# EAGLE design HHKBLite2BTwithoutArduinoFTDI (EAGLE 6.5.0)
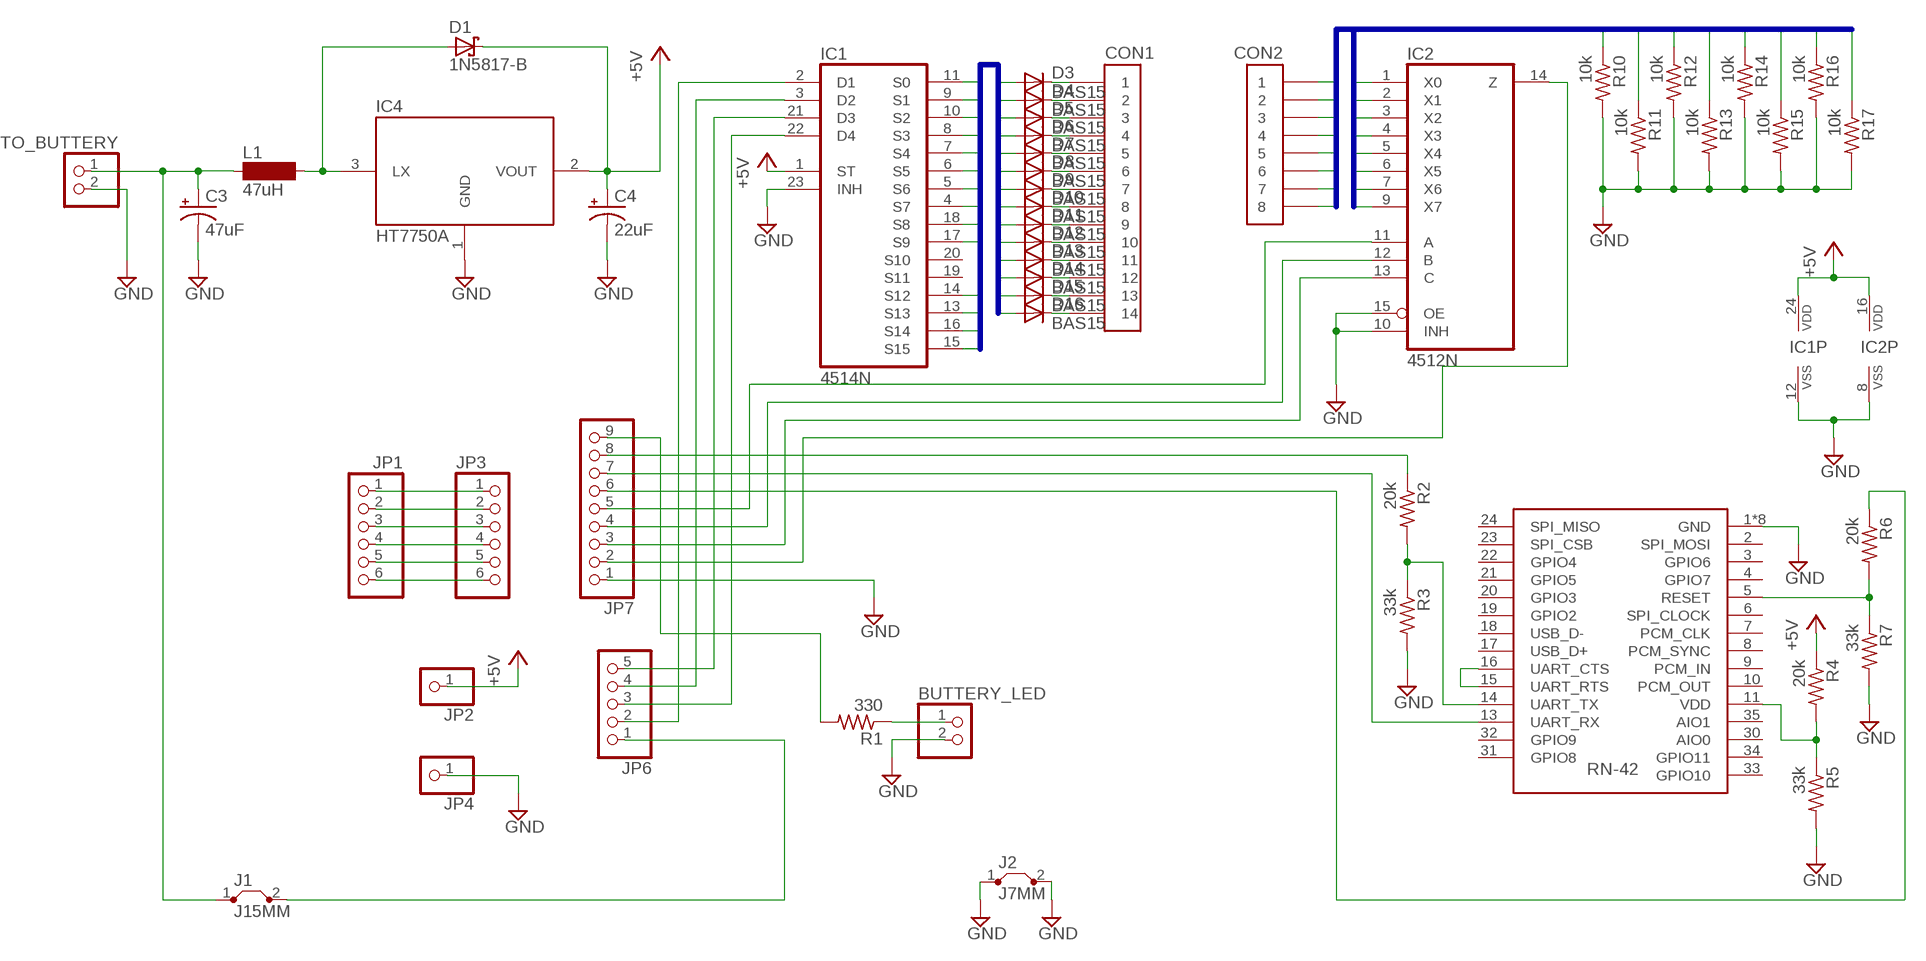
[diagram p0: schematic, sheet 1]

## Parts
BUTTERY_LED  PINHD-1X2  [1X02]
C3  47uF  CPOL-USE5-10.5  [E5-10,5]
C4  22uF  CPOL-USE5-10.5  [E5-10,5]
CON1  45045-1445  [52045-1445]
CON2  45045-0845  [52045-0845]
D1  1N5817-B  [DO41-7.6]
D3  BAS15  [DO34-7]
D4  BAS15  [DO34-7]
D5  BAS15  [DO34-7]
D6  BAS15  [DO34-7]
D7  BAS15  [DO34-7]
D8  BAS15  [DO34-7]
D9  BAS15  [DO34-7]
D10  BAS15  [DO34-7]
D11  BAS15  [DO34-7]
D12  BAS15  [DO34-7]
D13  BAS15  [DO34-7]
D14  BAS15  [DO34-7]
D15  BAS15  [DO34-7]
D16  BAS15  [DO34-7]
IC1  4514N  [DIL24-6]
IC2  4512N  [DIL16]
IC4  HT7750A  [TO-92]
J1  J15MM  [15]
J2  J7MM  [07]
JP1  PINHD-1X6  [1X06]
JP2  PINHD-1X1  [1X01]
JP3  PINHD-1X6/90  [1X06/90]
JP4  PINHD-1X1  [1X01]
JP6  PINHD-1X5  [1X05]
JP7  PINHD-1X9  [1X09]
L1  47uH  BS11  [BS11]
R1  330  R-US_0207/7  [0207/7]
R2  20k  R-US_0207/7  [0207/7]
R3  33k  R-US_0207/7  [0207/7]
R4  20k  R-US_0207/7  [0207/7]
R5  33k  R-US_0207/7  [0207/7]
R6  20k  R-US_0207/7  [0207/7]
R7  33k  R-US_0207/7  [0207/7]
R10  10k  R-US_0207/7  [0207/7]
R11  10k  R-US_0207/7  [0207/7]
R12  10k  R-US_0207/7  [0207/7]
R13  10k  R-US_0207/10  [0207/10]
R14  10k  R-US_0207/7  [0207/7]
R15  10k  R-US_0207/7  [0207/7]
R16  10k  R-US_0207/7  [0207/7]
R17  10k  R-US_0207/7  [0207/7]
TO_BUTTERY  PINHD-1X2  [1X02]
U$1  RN-42  [RN-42]

## Nets
+5V [Vcc]: C4.+ D1.C IC1.1(ST) IC1.24(VDD) IC2.16(VDD) IC4.2(VOUT) JP2.1 R4.1
CON1BUS_O0: D3.A IC1.11(S0)
CON1BUS_O1: D5.A IC1.9(S1)
CON1BUS_O2: D4.A IC1.10(S2)
CON1BUS_O3: D6.A IC1.8(S3)
CON1BUS_O4: D7.A IC1.7(S4)
CON1BUS_O5: D8.A IC1.6(S5)
CON1BUS_O6: D9.A IC1.5(S6)
CON1BUS_O7: D10.A IC1.4(S7)
CON1BUS_O8: D11.A IC1.18(S8)
CON1BUS_O9: D16.A IC1.17(S9)
CON1BUS_O12: D13.A IC1.14(S12)
CON1BUS_O13: D12.A IC1.13(S13)
CON1BUS_O14: D15.A IC1.16(S14)
CON1BUS_O15: D14.A IC1.15(S15)
CON2BUS_D0: CON2.8 IC2.1(X0) R10.1
CON2BUS_D1: CON2.7 IC2.2(X1) R11.1
CON2BUS_D2: CON2.6 IC2.3(X2) R12.1
CON2BUS_D3: CON2.5 IC2.4(X3) R13.1
CON2BUS_D4: CON2.4 IC2.5(X4) R14.1
CON2BUS_D5: CON2.3 IC2.6(X5) R15.1
CON2BUS_D6: CON2.2 IC2.7(X6) R16.1
CON2BUS_D7: CON2.1 IC2.9(X7) R17.1
GND [GND]: BUTTERY_LED.2 C3.- C4.- IC1.12(VSS) IC1.23(INH) IC2.8(VSS) IC2.10(INH) IC2.15(OE) IC4.1(GND) J2.1 J2.2 JP4.1 JP7.1 R3.2 R5.2 R7.2 R10.2 R11.2 R12.2 R13.2 R14.2 R15.2 R16.2 R17.2 TO_BUTTERY.2 U$1.1(GND) U$1.12(GND) U$1.28(GND) U$1.29(GND) U$1.GND1(GND) U$1.GND2(GND) U$1.GND3(GND) U$1.GND4(GND)
N$1: JP1.1 JP3.1
N$2: JP1.2 JP3.2
N$3 [VccSrc]: D1.A IC4.3(LX) L1.2
N$4 [VccSrc]: C3.+ J1.1 L1.1 TO_BUTTERY.1
N$5: JP1.3 JP3.3
N$6: JP7.6 R6.1
N$7: JP1.4 JP3.4
N$8: JP1.5 JP3.5
N$9: IC2.14(Z) JP7.2
N$10: JP1.6 JP3.6
N$12: J1.2 JP6.1
N$13: BUTTERY_LED.1 R1.1
N$14: JP7.9 R1.2
N$16: IC2.12(B) JP7.4
N$17: IC2.13(C) JP7.3
N$18: JP7.8 R2.1
N$19: JP7.7 U$1.13(UART_RX)
N$20: U$1.15(UART_RTS) U$1.16(UART_CTS)
N$21: R2.2 R3.1 U$1.14(UART_TX)
N$22: IC2.11(A) JP7.5
N$36: IC1.2(D1) JP6.2
N$37: IC1.3(D2) JP6.4
N$38: IC1.21(D3) JP6.5
N$39: IC1.22(D4) JP6.3
N$44: R4.2 R5.1 U$1.11(VDD)
N$46: R6.2 R7.1 U$1.5(RESET)
N$49: CON1.1 D3.C
N$50: CON1.2 D4.C
N$51: CON1.3 D5.C
N$52: CON1.4 D6.C
N$53: CON1.5 D7.C
N$54: CON1.6 D8.C
N$55: CON1.7 D9.C
N$56: CON1.8 D10.C
N$57: CON1.9 D11.C
N$58: CON1.10 D12.C
N$59: CON1.11 D13.C
N$60: CON1.12 D14.C
N$61: CON1.13 D15.C
N$62: CON1.14 D16.C
Unconnected: IC1.19(S11) IC1.20(S10) U$1.2(SPI_MOSI) U$1.3(GPIO6) U$1.4(GPIO7) U$1.6(SPI_CLOCK) U$1.7(PCM_CLK) U$1.8(PCM_SYNC) U$1.9(PCM_IN) U$1.10(PCM_OUT) U$1.17(USB_D+) U$1.18(USB_D-) U$1.19(GPIO2) U$1.20(GPIO3) U$1.21(GPIO5) U$1.22(GPIO4) U$1.23(SPI_CSB) U$1.24(SPI_MISO) U$1.30(AIO0) U$1.31(GPIO8) U$1.32(GPIO9) U$1.33(GPIO10) U$1.34(GPIO11) U$1.35(AIO1)

## Buses
CON2BUS_D[0..7]
CON1BUS_O[0..15]

## Library data of the parts
BUTTERY_LED TO_BUTTERY = pinhead:PINHD-1X2: PIN HEADER
C3 C4 = rcl:CPOL-US: POLARIZED CAPACITOR, American symbol
CON1 = 5204:45045-1445
CON2 = 5204:45045-0845
D1 = diode:1N581*: 1.0A SCHOTTKY BARRIER RECTIFIER Source: http://www.diodes.com/datasheets/ds23001.pdf
D3-D16 = diode:BAS15: DIODE high speed
IC1 = 45xx:4514: 4-bit latch 4-16 line DECODER
IC2 = 45xx:4512: 8-channel DATA SELECTOR Inhibit function corrected - 2005.10.04 librarian@cadsoft.de
IC4 = HT77XXA:HT7750A
J1 J2 = jumper:J: Bridge
JP1 JP3 = pinhead:PINHD-1X6: PIN HEADER
JP2 JP4 = pinhead:PINHD-1X1: PIN HEADER
JP6 = pinhead:PINHD-1X5: PIN HEADER
JP7 = pinhead:PINHD-1X9: PIN HEADER
L1 = inductor-neosid:BS: INDUCTOR nominal inductance, magnetically screened; OC_FARNELL: unknown; OC_NEWARK: unknown
R1-R7 R10-R12 R14-R17 = rcl:R-US_: RESISTOR, American symbol
R13 = resistor:R-US_: RESISTOR, American symbol
U$1 = RN-42:RN-42

## Net classes
0 default: clearance 0.254 mm
1 Vcc: width 0.025 mm, clearance 0.508 mm to class 0
2 VccSrc: clearance 0.508 mm to class 0, clearance 0.508 mm to class 1, clearance 0.508 mm
3 GND: clearance 0.305 mm to class 0, clearance 0.508 mm to class 1, clearance 0.508 mm to class 2

## Board
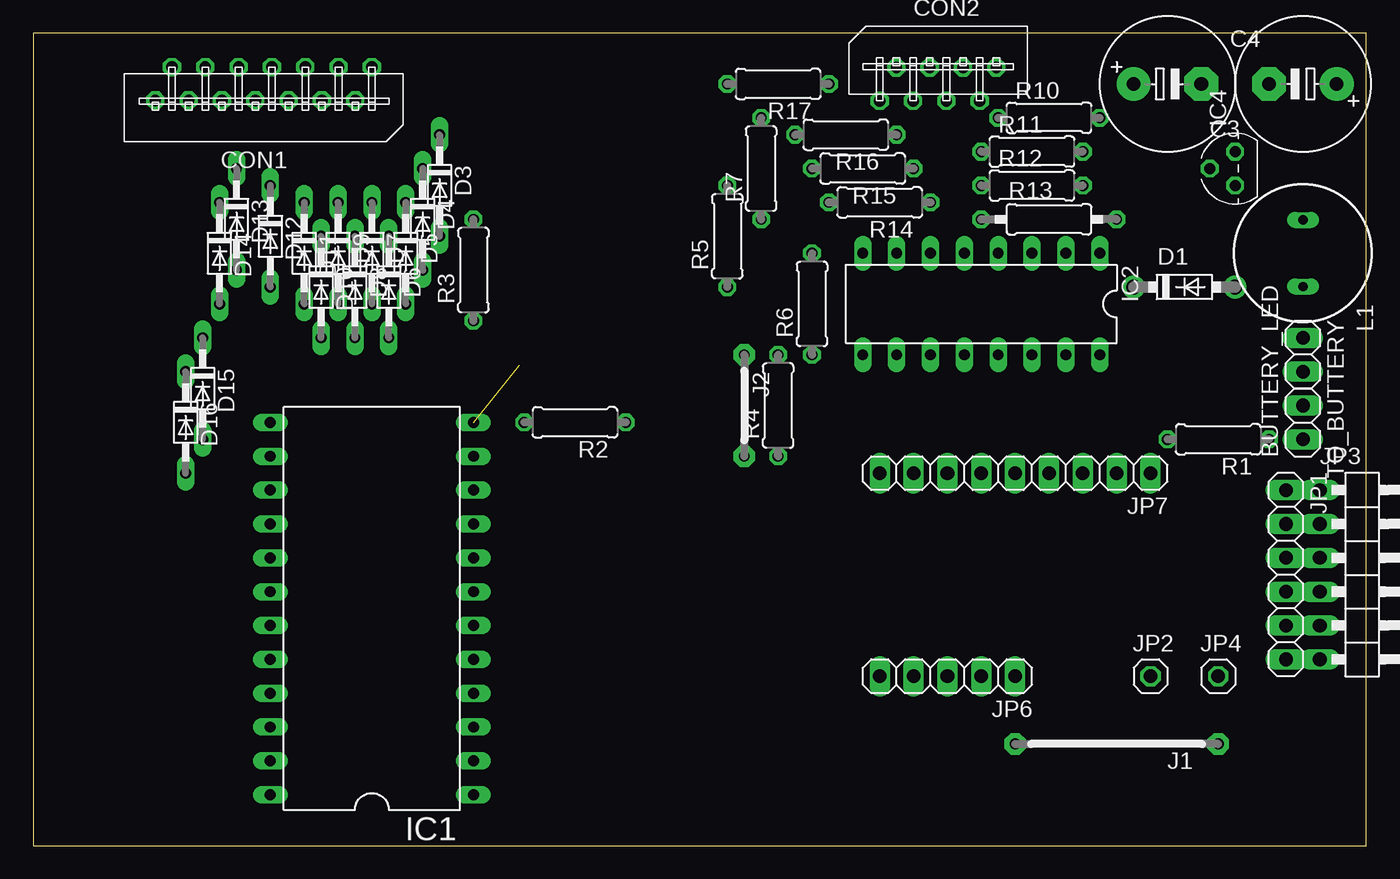
[diagram p1: board, top side]
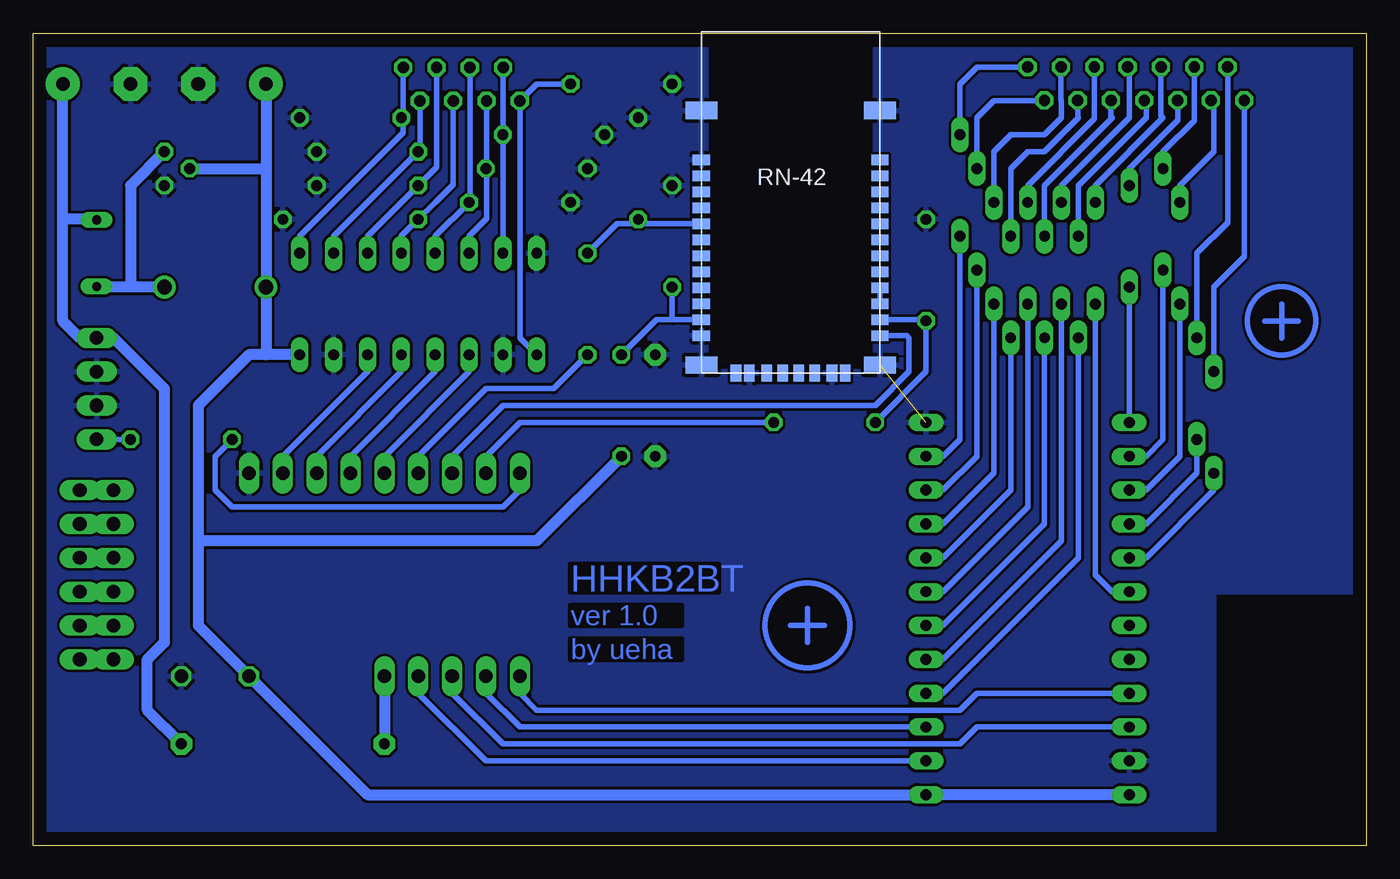
[diagram p2: board, bottom side, seen from below]

Size 100 x 60.95 mm. Coordinates in mm from the lower left corner, seen from the top.
Outline: 0,0 100,0 100,60.95 0,60.95 0,0
Copper layers (1*16): Top 0.035mm / dielectric 1.5mm / Bottom 0.035mm
Design rules "default": minimum track width 10mil, minimum drill 24mil, track to track 8mil, track to pad 8mil, pad to pad 8mil, via to via 8mil, smd to smd 8mil, copper to edge 40mil, drill to drill 8mil, minimum pad ring 10mil, minimum via ring 8mil, stop-mask expansion 4mil, vias tented up to drill 0mil, thermal gap 10mil

### Footprints (pad centres in the part's own frame; a part is rotated, then mirrored left to right if it is on the bottom)
1X02 = drill 1.016 long: 1 -1.27,0; 2 1.27,0
E5-10,5 = drill 1.016 pad 2.54: + -2.54,0 | drill 1.016 pad 2.54 octagon: - 2.54,0
52045-1445 = drill 0.85 octagon: 1 0,0; 2 1.25,2.5; 3 2.5,0; 4 3.75,2.5; 5 5,0; 6 6.25,2.5; 7 7.5,0; 8 8.75,2.5; 9 10,0; 10 11.25,2.5; 11 12.5,0; 12 13.75,2.5; 13 15,0; 14 16.25,2.5
52045-0845 = drill 0.85 octagon: 1 0,0; 2 1.25,2.5; 3 2.5,0; 4 3.75,2.5; 5 5,0; 6 6.25,2.5; 7 7.5,0; 8 8.75,2.5
DO41-7.6 = drill 1.1 pad 1.7: A 3.81,0; C -3.81,0
DO34-7 = drill 0.813 long: A 3.81,0; C -3.81,0
DIL24-6 = drill 0.813 long: 1 -13.97,-7.62; 2 -11.43,-7.62; 3 -8.89,-7.62; 4 -6.35,-7.62; 5 -3.81,-7.62; 6 -1.27,-7.62; 7 1.27,-7.62; 8 3.81,-7.62; 9 6.35,-7.62; 10 8.89,-7.62; 11 11.43,-7.62; 12 13.97,-7.62; 13 13.97,7.62; 14 11.43,7.62; 15 8.89,7.62; 16 6.35,7.62; 17 3.81,7.62; 18 1.27,7.62; 19 -1.27,7.62; 20 -3.81,7.62; 21 -6.35,7.62; 22 -8.89,7.62; 23 -11.43,7.62; 24 -13.97,7.62
DIL16 = drill 0.813 long: 1 -8.89,-3.81; 2 -6.35,-3.81; 3 -3.81,-3.81; 4 -1.27,-3.81; 5 1.27,-3.81; 6 3.81,-3.81; 7 6.35,-3.81; 8 8.89,-3.81; 9 8.89,3.81; 10 6.35,3.81; 11 3.81,3.81; 12 1.27,3.81; 13 -1.27,3.81; 14 -3.81,3.81; 15 -6.35,3.81; 16 -8.89,3.81
TO-92 = drill 0.813 octagon: 1 -1.27,0; 2 0,1.905; 3 1.27,0
15 = drill 0.813 pad 1.6 octagon: 1 -7.62,0; 2 7.62,0
07 = drill 0.813 pad 1.6 octagon: 1 -3.81,0; 2 3.81,0
1X06 = drill 1.016 long: 1 -6.35,0; 2 -3.81,0; 3 -1.27,0; 4 1.27,0; 5 3.81,0; 6 6.35,0
1X01 = drill 1.016 octagon: 1 0,0
1X06/90 = drill 1.016 long: 1 -6.35,-3.81; 2 -3.81,-3.81; 3 -1.27,-3.81; 4 1.27,-3.81; 5 3.81,-3.81; 6 6.35,-3.81
1X05 = drill 1.016 long: 1 -5.08,0; 2 -2.54,0; 3 0,0; 4 2.54,0; 5 5.08,0
1X09 = drill 1.016 long: 1 -10.16,0; 2 -7.62,0; 3 -5.08,0; 4 -2.54,0; 5 0,0; 6 2.54,0; 7 5.08,0; 8 7.62,0; 9 10.16,0
BS11 = drill 0.7 long: 1 -2.5,0; 2 2.5,0
0207/7 = drill 0.813 octagon: 1 -3.81,0; 2 3.81,0
0207/10 = drill 0.813 octagon: 1 -5.08,0; 2 5.08,0
RN-42 = smd 1.3 x 0.8: 1 -6.7,3.2; 2 -6.7,2; 3 -6.7,0.8; 4 -6.7,-0.4; 5 -6.7,-1.6; 6 -6.7,-2.8; 7 -6.7,-4; 8 -6.7,-5.2; 9 -6.7,-6.4; 10 -6.7,-7.6; 11 -6.7,-8.8; 12 -6.7,-10; 13 6.7,-10; 14 6.7,-8.8; 15 6.7,-7.6; 16 6.7,-6.4; 17 6.7,-5.2; 18 6.7,-4; 19 6.7,-2.8; 20 6.7,-1.6; 21 6.7,-0.4; 22 6.7,0.8; 23 6.7,2; 24 6.7,3.2 | smd 0.8 x 1.3: 28 3.1,-12.8; 29 -3.1,-12.8; 30 4.1,-12.8; 31 1.8,-12.8; 32 0.6,-12.8; 33 -0.6,-12.8; 34 -1.8,-12.8; 35 -4.1,-12.8 | smd 2.4 x 1.3: GND1 -6.7,6.9; GND2 6.7,6.9; GND3 -6.7,-12.2; GND4 6.7,-12.2

### Placement (x,y rotation side)
BUTTERY_LED  95.25,31.75 90 top
C3  95.25,57.15 180 top
C4  85.09,57.15 0 top
CON1  25.4,58.42 180 top
CON2  63.5,55.88 0 top
D1  86.36,41.91 0 top
D3  30.48,49.53 270 top
D4  29.21,46.99 270 top
D5  27.94,44.45 270 top
D6  26.67,41.91 270 top
D7  25.4,44.45 270 top
D8  24.13,41.91 270 top
D9  22.86,44.45 270 top
D10  21.59,41.91 270 top
D11  20.32,44.45 270 top
D12  17.78,45.72 270 top
D13  15.24,46.99 270 top
D14  13.97,44.45 270 top
D15  12.7,34.29 270 top
D16  11.43,31.75 270 top
IC1  25.4,17.78 90 top
IC2  71.12,40.64 180 top
IC4  90.17,50.8 90 top
J1  81.28,7.62 180 top
J2  53.34,33.02 270 top
JP1  93.98,20.32 270 top
JP2  83.82,12.7 0 top
JP3  100.33,20.32 270 top
JP4  88.9,12.7 0 top
JP6  68.58,12.7 180 top
JP7  73.66,27.94 180 top
L1  95.25,44.45 270 top
R1  88.9,30.48 180 top
R2  40.64,31.75 180 top
R3  33.02,43.18 90 top
R4  55.88,33.02 90 top
R5  52.07,45.72 90 top
R6  58.42,40.64 90 top
R7  54.61,50.8 90 top
R10  76.2,54.61 0 top
R11  74.93,52.07 0 top
R12  74.93,49.53 0 top
R13  76.2,46.99 0 top
R14  63.5,48.26 180 top
R15  62.23,50.8 180 top
R16  60.96,53.34 180 top
R17  55.88,57.15 180 top
TO_BUTTERY  95.25,36.83 270 top
U$1  43.18,48.26 0 bottom

### Tracks (layer width: path | path; a pad name or v marks a point on that pad's centre or on a via)
+5V
  Bottom 0.813: C4.+ 82.55,50.8 | 82.55,50.8 D1.C 82.55,36.83 | IC4.2 82.55,50.8 | R4.1 62.23,22.86 87.63,22.86 | 82.55,36.83 83.82,36.83 87.63,33.02 87.63,22.86 | IC2.16 82.55,36.83 | IC1.24 IC1.1 74.93,3.81 JP2.1 87.63,16.51 87.63,22.86
CON1BUS_O0
  Bottom 0.406: D3.A 30.48,30.48 31.75,29.21 IC1.11
CON1BUS_O1
  Bottom 0.406: D5.A 27.94,27.94 31.75,24.13 IC1.9
CON1BUS_O2
  Bottom 0.406: D4.A 29.21,29.21 31.75,26.67 IC1.10
CON1BUS_O3
  Bottom 0.406: D6.A 26.67,26.67 31.75,21.59 IC1.8
CON1BUS_O4
  Bottom 0.406: D7.A 25.4,25.4 31.75,19.05 IC1.7
CON1BUS_O5
  Bottom 0.406: D8.A 24.13,24.13 31.75,16.51 IC1.6
CON1BUS_O6
  Bottom 0.406: D9.A 22.86,22.86 31.75,13.97 IC1.5
CON1BUS_O7
  Bottom 0.406: D10.A 21.59,21.59 31.75,11.43 IC1.4
CON1BUS_O8
  Bottom 0.406: D11.A 20.32,20.32 19.05,19.05 IC1.18
CON1BUS_O9
  Bottom 0.406: D16.A 11.43,26.67 16.51,21.59 IC1.17
CON1BUS_O12
  Bottom 0.406: D13.A 15.24,30.48 16.51,29.21 IC1.14
CON1BUS_O13
  Bottom 0.406: D12.A IC1.13
CON1BUS_O14
  Bottom 0.406: D15.A 12.7,27.94 16.51,24.13 IC1.16
CON1BUS_O15
  Bottom 0.406: D14.A 13.97,29.21 16.51,26.67 IC1.15
CON2BUS_D0
  Bottom 0.406: CON2.8 72.25,54.61 | 72.25,54.61 72.25,53.48 80.01,45.72 IC2.1 | R10.1 72.25,54.61
CON2BUS_D1
  Bottom 0.406: CON2.7 71,52.19 R11.1 71.75,51.44 77.47,45.72 IC2.2
CON2BUS_D2
  Bottom 0.406: CON2.6 69.75,50.9 69.85,50.8 R12.1 74.93,45.72 IC2.3
CON2BUS_D3
  Bottom 0.406: CON2.5 68.5,49.61 69.85,48.26 R13.1 72.39,45.72 IC2.4
CON2BUS_D4
  Bottom 0.406: CON2.4 67.25,48.32 R14.1 69.85,45.72 IC2.5
CON2BUS_D5
  Bottom 0.406: CON2.3 66,50.8 | 66,50.8 66,47.03 67.31,45.72 IC2.6 | R15.1 66,50.8
CON2BUS_D6
  Bottom 0.406: CON2.2 64.75,53.34 | 64.75,53.34 64.75,44.47 IC2.7 | R16.1 64.75,53.34
CON2BUS_D7
  Bottom 0.406: IC2.9 63.5,38.1 CON2.1 62.23,57.15 R17.1
GND  (1 unrouted)
  pour Bottom: 0,19.05 11.43,19.05 11.43,0 100.33,0 100.33,60.96 49.53,60.96 49.53,35.56 36.83,35.56 36.83,60.96 0,60.96
N$1
  Bottom 0.406: JP3.1 JP1.1
N$2
  Bottom 0.406: JP3.2 JP1.2
N$3
  Bottom 0.813: D1.A 92.71,41.91 | 92.71,41.91 95.21,41.91 L1.2 | IC4.3 92.71,49.53 92.71,41.91
N$4
  Bottom 0.813: L1.1 95.29,46.99 97.79,46.99 | 97.79,46.99 97.79,39.37 96.52,38.1 TO_BUTTERY.1 93.98,38.1 90.17,34.29 90.17,15.24 91.44,13.97 91.44,10.16 J1.1 | 97.79,46.99 C3.+
N$5
  Bottom 0.406: JP3.3 JP1.3
N$6
  Bottom 0.406: R6.1 60.96,34.29 66.04,34.29 71.12,29.21 JP7.6
N$7
  Bottom 0.406: JP3.4 JP1.4
N$8
  Bottom 0.406: JP3.5 JP1.5
N$9
  Bottom 0.406: IC2.14 74.93,35.56 81.28,29.21 JP7.2
N$10
  Bottom 0.406: JP3.6 JP1.6
N$12
  Bottom 0.813: JP6.1 J1.2
N$13
  Bottom 0.406: R1.1 BUTTERY_LED.1
N$14
  Bottom 0.406: JP7.9 63.5,26.67 64.77,25.4 85.09,25.4 86.36,26.67 86.36,29.21 R1.2
N$15
  Bottom 0.406: 5.08,39.37 6.35,39.37 | 7.62,39.37 6.35,39.37 | 6.35,39.37 6.35,40.64 | 6.35,39.37 6.35,38.1
N$16
  Bottom 0.406: IC2.12 69.85,35.56 76.2,29.21 JP7.4
N$17
  Bottom 0.406: IC2.13 72.39,35.56 78.74,29.21 JP7.3
N$18
  Bottom 0.406: R2.1 63.5,31.75 66.04,29.21 JP7.8
N$19
  Bottom 0.406: U$1.13 34.45,38.26 34.29,38.1 34.29,35.56 36.83,33.02 64.77,33.02 68.58,29.21 JP7.7
N$20
  Bottom 0.406: U$1.16 U$1.15
N$21
  Bottom 0.406: U$1.14 33.11,39.46 R3.1 33.02,35.56 R2.2
N$22
  Bottom 0.406: JP7.5 73.66,29.21 67.31,35.56 IC2.11
N$23
  Bottom 0.406: 40.64,16.51 43.18,16.51
N$24
  Bottom 0.406: 41.91,17.78 41.91,15.24
N$36
  Bottom 0.406: IC1.2 66.04,6.35 71.12,11.43 JP6.2
N$37
  Bottom 0.406: IC1.3 63.5,8.89 66.04,11.43 JP6.4
N$38
  Bottom 0.406: IC1.21 29.21,11.43 30.48,10.16 62.23,10.16 63.5,11.43 JP6.5
N$39
  Bottom 0.406: IC1.22 29.21,8.89 30.48,7.62 64.77,7.62 68.58,11.43 JP6.3
N$44
  Bottom 0.406: U$1.11 52.07,39.46 | 52.07,39.46 53.25,39.46 R4.2 | R5.1 52.07,39.46
N$46
  Bottom 0.406: U$1.5 54.61,46.66 | 54.61,46.66 56.21,46.66 R6.2 | R7.1 54.61,46.66
N$49
  Bottom 0.406: CON1.1 29.21,58.42 30.48,57.15 D3.C
N$50
  Bottom 0.406: D4.C 29.21,54.61 27.94,55.88 24.19,55.88 CON1.2
N$51
  Bottom 0.406: CON1.3 22.9,55.92 22.86,55.88 22.86,54.61 24.13,53.34 26.67,53.34 27.94,52.07 D5.C
N$52
  Bottom 0.406: CON1.4 21.65,54.67 21.59,54.61 24.13,52.07 25.4,52.07 26.67,50.8 D6.C
N$53
  Bottom 0.406: CON1.5 20.4,54.53 25.4,49.53 D7.C
N$54
  Bottom 0.406: CON1.6 19.15,54.71 19.05,54.61 24.13,49.53 D8.C
N$55
  Bottom 0.406: D9.C 22.86,49.53 17.78,54.61 17.78,58.3 CON1.7
N$56
  Bottom 0.406: D10.C 21.59,49.53 16.51,54.61 16.51,55.78 CON1.8
N$57
  Bottom 0.406: CON1.9 15.4,54.77 15.24,54.61 20.32,49.53 D11.C
N$58
  Bottom 0.406: CON1.10 14.15,54.43 17.78,50.8 D12.C
N$59
  Bottom 0.406: CON1.11 12.9,54.41 15.24,52.07 D13.C
N$60
  Bottom 0.406: CON1.12 11.47,55.92 11.43,55.88 11.43,52.07 13.97,49.53 D14.C
N$61
  Bottom 0.406: CON1.13 10.4,46.75 12.7,44.45 D15.C
N$62
  Bottom 0.406: CON1.14 9.15,44.19 11.43,41.91 D16.C
(copper drawn outside any net)
  shapes: Bottom circle x2

### Text on the board
Bottom: HHKB2BT | ver 1.0 | by ueha